# EAGLE design micro-lrs (EAGLE 7.2.0)
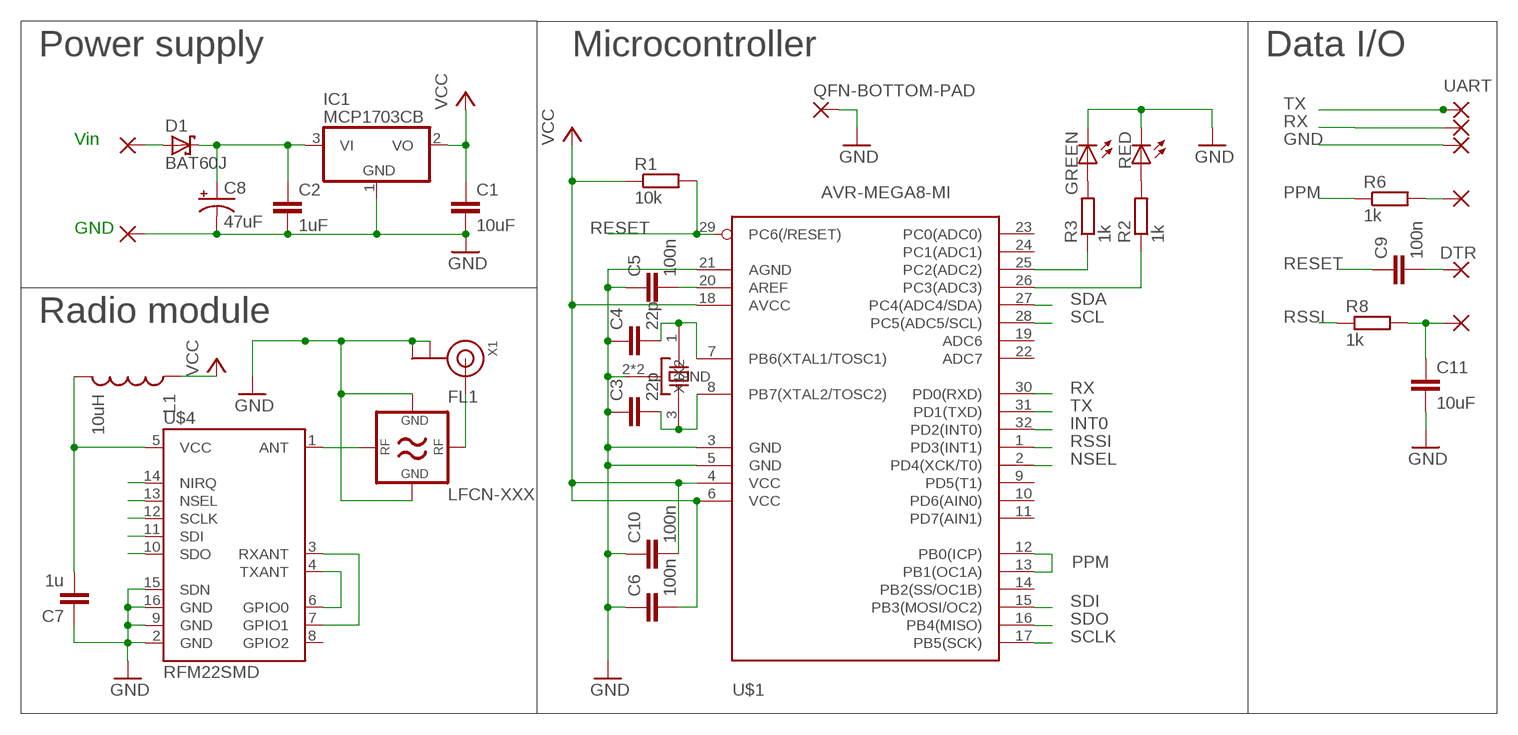
[diagram p0: schematic, sheet 1]

## Parts
+5V  SMD2  [SMD1,27-2,54]
C1  10uF  C-EUC0603  [C0603]
C2  1uF  C-EUC0603  [C0603]
C3  22p  C-EUC0603K  [C0603K]
C4  22p  C-EUC0603K  [C0603K]
C5  100n  C-EUC0603K  [C0603K]
C6  100n  C-EUC0603K  [C0603K]
C7  1u  C-EUC0402  [C0402]
C8  47uF  CAP_POL1206  [EIA3216]
C9  100n  C-EUC0603K  [C0603K]
C10  100n  C-EUC0603K  [C0603K]
C11  10uF  C-EUC0603  [C0603]
D1  BAT60J  [SOD323_ST]
DTR  SMD2  [SMD1,27-2,54]
FL1  LFCN-XXX  [FV1206]
GND  SMD2  [SMD1,27-2,54]
IC1  MCP1703CB  [SOT23]
L1  10uH  INDUCTOR1210  [1210]
LED1  GREEN  LEDCHIPLED_0603  [CHIPLED_0603]
LED2  RED  LEDCHIPLED_0603  [CHIPLED_0603]
PPM  SMD2  [SMD1,27-2,54]
QFN-BOTTOM-PAD  QFN-PAD  [SMD100X100]
R1  10k  R-EU_R0603  [R0603]
R2  1k  R-EU_R0603  [R0603]
R3  1k  R-EU_R0603  [R0603]
R6  1k  R-EU_R0603  [R0603]
R8  1k  R-EU_R0603  [R0603]
RSSI  SMD2  [SMD1,27-2,54]
RX  SMD2  [SMD1,27-2,54]
TX  SMD2  [SMD1,27-2,54]
U$1  AVR-MEGA8-MI  [MLF32]
U$2  CTS_32X25_SMD  [CTS_32X25]
U$4  RFM22SMD  [RFM22-XXX-S2]
UART-GND  SMD2  [SMD1,27-2,54]
X1  ANTENNA_U.FL  [U.FL]

## Nets
ANT-PAD: FL1.1(IO1) U$4.1(ANT)
AREF: C5.2 U$1.20(AREF)
DTR: C9.2 DTR.1(P)
GND: C1.2 C2.2 C3.1 C4.1 C5.1 C6.1 C7.1 C8.C(-) C10.1 C11.2 FL1.3(GND2) FL1.4(GND1) GND.1(P) IC1.1(GND) LED1.C LED2.C QFN-BOTTOM-PAD.P$2(P) U$1.3(GND) U$1.5(GND) U$1.21(AGND) U$2.2(GND) U$2.4(GND) U$4.2(GND) U$4.9(GND) U$4.15(SDN) U$4.16(GND) UART-GND.1(P) X1.1(GND) X1.2(GND)
INT0: U$1.32(PD2(INT0)) U$4.14(NIRQ)
N$2: C4.2 U$1.7(PB6(XTAL1/TOSC1)) U$2.1(X1)
N$3: C3.2 U$1.8(PB7(XTAL2/TOSC2)) U$2.3(X2)
N$4: R3.1 U$1.25(PC2(ADC2))
N$5: R2.1 U$1.26(PC3(ADC3))
N$7: LED1.A R3.2
N$8: LED2.A R2.2
N$12: FL1.2(IO2) X1.3(SIGNAL)
N$16: U$4.4(TXANT) U$4.6(GPIO0)
N$17: U$4.3(RXANT) U$4.7(GPIO1)
NSEL: U$1.2(PD4(XCK/T0)) U$4.13(NSEL)
PPM: R6.1 U$1.12(PB0(ICP)) U$1.13(PB1(OC1A))
PPMPAD: PPM.1(P) R6.2
RESET: C9.1 R1.2 U$1.29(PC6(/RESET))
RSSI: R8.1 U$1.1(PD3(INT1))
RSSIPAD: C11.1 R8.2 RSSI.1(P)
RX: RX.1(P) U$1.30(PD0(RXD))
SCL: U$1.28(PC5(ADC5/SCL))
SCLK: U$1.17(PB5(SCK)) U$4.12(SCLK)
SDA: U$1.27(PC4(ADC4/SDA))
SDI: U$1.15(PB3(MOSI/OC2)) U$4.11(SDI)
SDO: U$1.16(PB4(MISO)) U$4.10(SDO)
TX: TX.1(P) U$1.31(PD1(TXD))
VCC: C1.1 C6.2 C10.2 IC1.2(VO) L1.1 R1.1 U$1.4(VCC) U$1.6(VCC) U$1.18(AVCC)
VCC-RADIO: C7.2 L1.2 U$4.5(VCC)
VIN: C2.1 C8.A(+) D1.C IC1.3(VI)
VIN-BEFORE-DIODE: +5V.1(P) D1.A
Unconnected: U$1.9(PD5(T1)) U$1.10(PD6(AIN0)) U$1.11(PD7(AIN1)) U$1.14(PB2(SS/OC1B)) U$1.19(ADC6) U$1.22(ADC7) U$1.23(PC0(ADC0)) U$1.24(PC1(ADC1)) U$4.8(GPIO2)

## Notes on the sheet
- Power supply | Microcontroller | Data I/O
- UART
- Vin
- GND
- Radio module

## Library data of the parts
+5V DTR GND PPM RSSI RX TX UART-GND = wirepad:SMD2: SMD PAD
C1-C7 C9-C11 = resistor:C-EU: CAPACITOR, European symbol
C8 = SparkFun-Capacitors:CAP_POL: Capacitor Polarized These are standard SMD and PTH capacitors. Normally 10uF, 47uF, and 100uF in electrolytic and tantalum varieties. Always verify the external diameter of the through hole cap, it varies with capacity, voltage, and manufacturer. The EIA devices should be standard.
D1 = diode:BAT60J: Schottky barrier diode Source: www.st.com, BAT60J.pdf
FL1 = mini-circuits:LFCN-XXX: CERAMIC LOW PASS FILTER
IC1 = linear:MCP1703: 250 mA, 16V, Low Quiescent Current LDO Regulator Source: http://ww1.microchip.com/downloads/en/DeviceDoc/22049b.pdf
L1 = SparkFun:INDUCTOR: Inductors Basic Inductor/Choke - 0603 and 1206. Footprints are not proven and vary greatly between part numbers.
LED1 LED2 = led:LED: LED OSRAM: - CHIPLED LG R971, LG N971, LY N971, LG Q971, LY Q971, LO R971, LY R971 LH N974, LH R974 LS Q976, LO Q976, LY Q976 LO Q996 - Hyper CHIPLED LW Q18S LB Q993, LB Q99A, LB R99A - SideLED LS A670, LO A670, LY A670, LG A670, LP A670 LB A673, LV A673, LT A673, LW A673 LH A674 LY A675 LS A676, LA A676, LO A676, LY A676, LW A676 LS A679, LY A679, LG A679 - Hyper Micro SIDELED® LS Y876, LA Y876, LO Y876, LY Y876 LT Y87S - SmartLED LW L88C, LW L88S LB L89C, LB L89S, LG L890 LS L89K, LO L89K, LY L89K LS L896, LA L896, LO L896, LY L896 - TOPLED LS T670, LO T670, LY T670, LG T670, LP T670 LSG T670, LSP T670, LSY T670, LOP T670, LYG T670 LG T671, LOG T671, LSG T671 LB T673, LV T673, LT T673, LW T673 LH T674 LS T676, LA T676, LO T676, LY T676, LB T676, LH T676, LSB T676, LW T676 LB T67C, LV T67C, LT T67C, LS T67K, LO T67K, LY T67K, LW E67C LS E67B, LA E67B, LO E67B, LY E67B, LB E67C, LV E67C, LT E67C LW T67C LS T679, LY T679, LG T679 LS T770, LO T770, LY T770, LG T770, LP T770 LB T773, LV T773, LT T773, LW T773 LH T774 LS E675, LA E675, LY E675, LS T675 LS T776, LA T776, LO T776, LY T776, LB T776 LHGB T686 LT T68C, LB T68C - Hyper Mini TOPLED® LB M676 - Mini TOPLED Santana® LG M470 LS M47K, LO M47K, LY M47K Source: http://www.osram.convergy.de - LUMILED® LXK2-PW12-R00, LXK2-PW12-S00, LXK2-PW14-U00, LXK2-PW14-V00 LXK2-PM12-R00, LXK2-PM12-S00, LXK2-PM14-U00 LXK2-PE12-Q00, LXK2-PE12-R00, LXK2-PE12-S00, LXK2-PE14-T00, LXK2-PE14-U00 LXK2-PB12-K00, LXK2-PB12-L00, LXK2-PB12-M00, LXK2-PB14-N00, LXK2-PB14-P00, LXK2-PB14-Q00 LXK2-PR12-L00, LXK2-PR12-M00, LXK2-PR14-Q00, LXK2-PR14-R00 LXK2-PD12-Q00, LXK2-PD12-R00, LXK2-PD12-S00 LXK2-PH12-R00, LXK2-PH12-S00 LXK2-PL12-P00, LXK2-PL12-Q00, LXK2-PL12-R00 Source: www.luxeon.com
QFN-BOTTOM-PAD = wirepad2:QFN-PAD: SMD PAD
R1-R3 R6 R8 = resistor:R-EU_: RESISTOR, European symbol
U$1 = SparkFun:AVR-MEGA8: MICROCONTROLLER 8 Kbytes FLASH 1 kbytes SRAM 512 bytes EEPROM USART 6-channel 10 bit ADC 2-channel 8 bit ADC
U$2 = cts_crystal:CTS_32X25_SMD
U$4 = SparkFun-RF-small:RFM22: The RFM22 is a low-power, low cost radio that is capable of operating in the 434MHz and 900MHz open bands. It's frequency is software defined and there are some very good libraries written for it.
X1 = adafruit:ANTENNA_U.FL: U.FL Antenna Connector

## Board
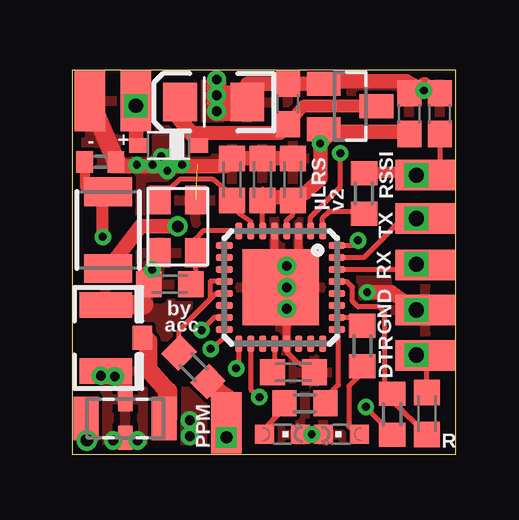
[diagram p1: board, top side]
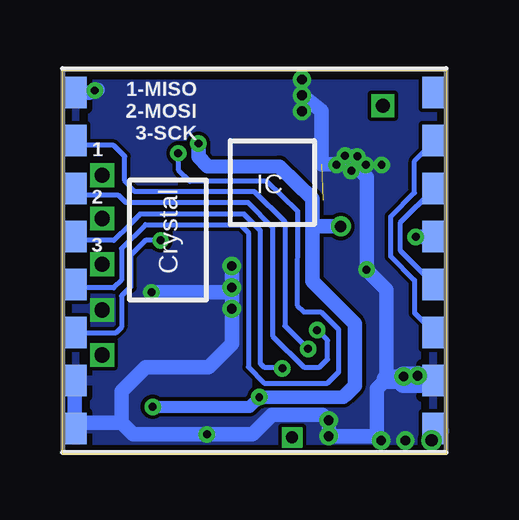
[diagram p2: board, bottom side, seen from below]

Size 16 x 16 mm. Coordinates in mm from the lower left corner, seen from the top.
Outline: 0,0 16,0 16,16 0,16 0,0
Copper layers (1*16): Top 0.0356mm / dielectric 1.5011mm / Bottom 0.0356mm
Design rules "oshpark-design-rules *": minimum track width 6mil, minimum drill 13mil, track to track 6mil, track to pad 6mil, pad to pad 6mil, via to via 6mil, smd to smd 6mil, copper to edge 15mil, drill to drill 6mil, minimum pad ring 7mil, minimum via ring 7mil, stop-mask expansion 3mil, vias tented up to drill 25mil, thermal gap 10mil

### Footprints (pad centres in the part's own frame; a part is rotated, then mirrored left to right if it is on the bottom)
SMD1,27-2,54 = smd 1.27 x 2.54: 1 0,0
C0603 = smd 1.1 x 1: 1 -0.85,0; 2 0.85,0
C0603K = smd 1.05 x 1.08: 1 -0.875,0; 2 0.875,0
C0402 = smd 0.7 x 0.9: 1 -0.65,0; 2 0.65,0
EIA3216 = smd 1.4 x 1.6: A 1.4,0; C -1.4,0
SOD323_ST = smd 0.8 x 0.6: A 1.25,0; C -1.25,0
FV1206 = smd 1.04 x 1.8: 1 -1.625,0; 2 1.625,0 | smd 0.6 x 1: 3 0,0.8; 4 0,-0.8
SOT23 = smd 1 x 1.4: 1 -0.95,-1.1; 2 0.95,-1.1; 3 0,1.1
1210 = smd 1.2 x 2: 1 -1.6,0; 2 1.6,0
CHIPLED_0603 = smd 0.8 x 0.8: A 0,-0.75; C 0,0.75
SMD100X100 = smd 3.175 x 3.175: P$2 0,0
R0603 = smd 1 x 1.1: 1 -0.85,0; 2 0.85,0
MLF32 = smd 0.7 x 0.3: 1 -2.35,1.75; 2 -2.35,1.25; 3 -2.35,0.75; 4 -2.35,0.25; 5 -2.35,-0.25; 6 -2.35,-0.75; 7 -2.35,-1.25; 8 -2.35,-1.75; 17 2.35,-1.75; 18 2.35,-1.25; 19 2.35,-0.75; 20 2.35,-0.25; 21 2.35,0.25; 22 2.35,0.75; 23 2.35,1.25; 24 2.35,1.75 | smd 0.3 x 0.7: 9 -1.75,-2.35; 10 -1.25,-2.35; 11 -0.75,-2.35; 12 -0.25,-2.35; 13 0.25,-2.35; 14 0.75,-2.35; 15 1.25,-2.35; 16 1.75,-2.35; 25 1.75,2.35; 26 1.25,2.35; 27 0.75,2.35; 28 0.25,2.35; 29 -0.25,2.35; 30 -0.75,2.35; 31 -1.25,2.35; 32 -1.75,2.35
CTS_32X25 = smd 1.2 x 0.9: 1 -1.1,-0.7; 2 1.1,-0.7; 3 1.1,0.8; 4 -1.1,0.8
RFM22-XXX-S2 = smd 1 x 1.3: 1 -7.5,7; 2 -7.5,5; 3 -7.5,3; 4 -7.5,1; 5 -7.5,-1; 6 -7.5,-3; 7 -7.5,-5; 8 -7.5,-7; 9 7.5,-7; 10 7.5,-5; 11 7.5,-3; 12 7.5,-1; 13 7.5,1; 14 7.5,3; 15 7.5,5; 16 7.5,7
U.FL = smd 2.2 x 1.05: 1 0,1.375; 2 0,-1.375 | smd 0.8 x 1: 3 1.525,0

### Placement (x,y rotation side)
+5V  2.64,14.73 180 top
C1  14.05,14.2 90 top
C2  8.99,14.61 90 top
C3  4.06,7.09 0 top
C4  6.65,11.46 270 top
C5  9.22,3.43 180 top
C6  9.19,11.46 270 top
C7  1.17,12.19 180 top
C8  5.89,14.68 180 top
C9  14.78,1.7 90 top
C10  7.92,11.46 270 top
C11  15.32,14.2 90 top
D1  4.01,12.88 180 top
DTR  14.73,4.11 90 top
FL1  2.21,1.5 0 top
GND  0.74,14.73 180 top
IC1  11.58,14.5 270 top
L1  1.5,9.35 90 top
LED1  8.76,0.84 270 top
LED2  11.23,0.84 90 top
PPM  6.43,1.32 180 top
QFN-BOTTOM-PAD  8.69,6.96 0 top
R1  13.34,1.68 90 top
R2  12.09,4.52 270 top
R3  9.7,2.13 180 top
R6  5.05,3.63 315 top
R8  12.17,10.87 90 top
RSSI  14.73,11.63 90 top
RX  14.73,7.9 90 top
TX  14.73,9.83 90 top
U$1  8.69,6.96 270 top
U$2  4.34,9.5 270 top
U$4  8,8.08 180 bottom
UART-GND  14.73,6.02 270 top
X1  1.4,4.85 0 top

### Tracks (layer width: path | path; a pad name or v marks a point on that pad's centre or on a via)
ANT-PAD  (via drill 0.51)
  Top 0.813: FL1.1 0.66,1.07 v0.61,0.58
  Bottom 0.406: 0.29,0.99 U$4.1
  Bottom 0.813: v0.61,0.58 0.33,0.99 0.29,0.99
AREF
  Top 0.203: U$1.20 8.44,3.55 C5.2
DTR  (via drill 0.64)
  Top 0.203: C9.2 14.78,4.04 DTR.1
  Top 0.406: DTR.1 15.16,3.99 v14.35,4.14
GND  (via drill 0.33, 0.41, 0.64)  (1 unrouted)
  Top 0.203: v3.33,7.7 3.17,6.89 C3.1 2.97,7.1 2.97,7.59 | LED1.C 9.65,0.79 | U$1.21 8.96,4.25 9.35,3.86 9.64,3.73 C5.1 | 8.44,6.96 QFN-BOTTOM-PAD.P$2 | U$2.2 3.67,8.29 | LED1.C LED2.C | v9.98,0.84 9.7,0.72 LED1.C | C8.C 7.18,15.34 C2.2
  Top 0.305: 8.44,6.96 U$1.5 | U$1.3 9.44,6.96 v8.94,6.96 QFN-BOTTOM-PAD.P$2 v8.94,6.96 U$1.21
  Top 0.406: 3.67,8.29 v3.33,7.7 | v3.33,7.7 2.97,7.59 | 2.97,6.23 v3.33,7.7 | v14.35,6.02 14.5,6.12 UART-GND.1 | v1.7,0.58 1.89,0.58 FL1.4 2.53,0.58 v2.72,0.58 | v4.9,0.76 v4.9,1.42
  Top 0.61: C6.1 C10.1 C4.1 | 10.08,15.58 IC1.1 | 6.34,12.09 C4.1 | C2.2 7.31,15.45 IC1.1 | IC1.1 10.6,15.45 10.69,15.54 13.94,15.54 v14.66,15.16 14.2,15.29 C1.2 14.68,15.42 C11.2 | v12.29,6.76 13.31,6.76 v14.35,6.02 | 2.19,2.52 2.18,3.26 v1.78,3.25 1.78,3.28 v1.19,3.28 | X1.2 2.21,3.48 FL1.3 | v3.96,11.81 3.89,12.42 v4.22,12.45 | C7.1 2,12.01 6.34,12.01 arc90 C4.1
  Top 0.813: X1.1 2.97,6.23 | GND.1 1.8,12.23 C7.1 | v6.02,14.96 7.01,14.96 C8.C | v6.02,14.3 6.91,14.3 C8.C | v6.02,15.62 6.02,14.68 C8.C
  Bottom 0.61: v8.94,7.85 v8.94,6.96 | v8.94,6.96 v8.94,6.07 U$1.21 9.91,3.63 12.55,3.63 13.54,2.64 13.54,1.32 | v14.66,15.16 14.53,15.19 14.89,15.08 U$4.9 | 3.83,12.09 5.21,12.09 5.21,14.33 v6.02,14.96 | 3.83,12.09 3.3,11.56 3.3,7.72 v3.33,7.7 2.49,6.86 2.49,3.12 2.9,2.74 2.9,0.76 | v12.29,6.76 9.14,6.76 v8.94,6.96 | 13.54,1.32 13.06,0.84 v9.98,0.84 8.08,0.84 7.26,1.65 5.16,1.65 4.93,1.42 v4.9,1.42 v4.9,0.76 2.97,0.76 | 13.54,1.32 15.26,1.32 U$4.16 U$4.15 | 2.97,0.76 2.9,0.76 | 2.97,0.76 2.79,0.58 v2.72,0.58 2.9,0.76 | v4.22,12.45 v3.71,12.42 3.83,12.14 3.83,12.09 | 1.78,3.12 v1.78,3.25
  Bottom 0.813: U$4.2 0.61,2.97 1.78,2.97 v1.78,3.25 1.19,3.25 v1.19,3.28 | 2.49,3.12 1.78,3.12
  other vias: 3.35,12.06 2.69,12.06 4.57,12.06
  pour Top: -0.99,16.84 16.84,16.84 17.17,-0.66 -0.66,-0.66
  pour Bottom: -0.99,16.84 16.84,16.84 16.84,-0.66 -0.99,-0.66
INT0  (via drill 0.33)
  Top 0.203: U$1.32 11.71,8.71 v11.91,8.91
  Bottom 0.203: v11.91,8.91 12.55,8.91 13.16,8.31 13.16,6.99 13.54,6.6 13.54,5.31 13.79,5.05 15.48,5.05 U$4.14 15.29,5.28
N$1  (via drill 0.64)
  other vias: 14.35,7.92
N$2
  Top 0.203: U$2.1 3.73,10.66 3.73,10.77 4.47,11.46 5.87,11.46 6.51,10.91 C4.2 6.91,10.66 6.96,10.03 7.44,9.71 U$1.7
N$3
  Top 0.203: U$1.8 5.45,9.31 5.13,8.99 5.13,8.44 U$2.3 5.17,7.08 C3.2
N$4
  Top 0.203: R3.1 10.55,2.35 11.1,2.9 11.1,5.15 U$1.25
N$5
  Top 0.203: U$1.26 11.78,5.71 R2.1
N$7
  Top 0.203: R3.2 8.85,1.92 7.8,0.86 7.9,0.83 LED1.A
N$8
  Top 0.203: 11.81,0.6 LED2.A 11.53,1.16 11.53,2.85 12.14,3.43 R2.2
N$12
  Top 0.406: X1.3 2.97,5.08 | 3.96,1.5 FL1.2
  Top 0.762: 3.96,2.64 3.15,3.56 3.15,4.72 X1.3
  Top 0.813: 3.96,2.64 3.96,1.5
N$14  (via drill 0.64)
  other vias: 14.35,9.83
N$15  (via drill 0.64)
  other vias: 14.35,11.63
N$16
  Bottom 0.203: 0.81,11.08 U$4.6 1.91,9.67 1.91,8.48 U$4.4
N$17
  Bottom 0.203: U$4.7 0.5,13.04 1.32,12.22 1.32,10.9 2.31,9.91 2.31,8.26 1.32,7.26 1.32,5.9 U$4.3 0.79,5.08
NSEL  (via drill 0.33)
  Top 0.203: U$1.2 9.94,9.89 11.18,11.15 v11.18,12.55
  Bottom 0.203: U$4.13 15.36,6.93 13.87,6.93 13.54,7.26 13.54,8.59 12.55,9.58 8.59,9.58 8.26,9.25 8.26,3.63 7.59,2.97 4.95,2.97 4.5,3.43 4.5,5.21 5.23,5.94 5.94,5.94 6.22,6.22 6.2,10.13 7.49,11.38 10.69,11.38 11.18,11.86 v11.18,12.55
PPM
  Top 0.203: U$1.13 6.07,6.71 6.02,6.73 5.75,6.46 | U$1.12 5.75,7.21 5.75,6.46 | R6.1 4.45,5.17 5.75,6.46
PPMPAD  (via drill 0.5)
  Top 0.203: 6.59,2.22 PPM.1
  Top 0.406: PPM.1 v6.43,0.71
  Top 0.813: 6.59,2.22 6.21,2.48 R6.2
RESET
  Top 0.203: C9.1 13.34,2.25 R1.2 13.03,2.73 13.03,5.92 12.8,6.15 11.91,6.15 11.68,6.38 11.68,6.96 11.43,7.21 U$1.29
RSSI
  Top 0.203: R8.1 12.37,10.41 12.52,10.24 11.86,10.19 11.84,10.13 10.72,10.13 10.44,9.85 U$1.1
RSSIPAD
  Top 0.203: C11.1 15.32,12.19 RSSI.1
  Top 0.508: RSSI.1 14.81,11.71 14.55,11.79 R8.2
RX
  Top 0.203: U$1.30 14.41,7.71 RX.1
SCLK  (via drill 0.33)
  Top 0.203: U$1.17 6.94,3.69 v6.83,3.58
  Bottom 0.203: 15.27,8.99 15.4,9.2 U$4.12 15.34,8.91 13.87,8.91 13.21,9.58 12.88,9.91 12.78,10.01 8.43,10.01 7.75,9.32 7.75,3.79 7.59,3.63 6.88,3.63 v6.83,3.58
SDI  (via drill 0.33)
  Top 0.203: U$1.15 5.91,5.71 v5.38,5.18
  Bottom 0.203: 15.06,10.77 15.49,10.9 15.24,10.85 15.67,11.08 U$4.11 15.45,10.79 13.66,10.79 13.36,10.49 8.26,10.49 7.24,9.47 7.24,4.93 5.94,3.63 5.28,3.63 4.95,3.96 4.95,4.75 v5.38,5.18
SDO  (via drill 0.33)
  Top 0.203: U$1.16 6.34,4.86 v5.77,4.39
  Bottom 0.203: U$4.10 15.3,12.88 13.87,12.88 13.41,12.42 13.41,11.4 12.98,10.95 8,10.95 6.73,9.7 6.73,5.36 v5.77,4.39
TX
  Top 0.203: U$1.31 12.17,8.21 13.79,9.83 TX.1
VCC  (via drill 0.33, 0.48)
  Top 0.203: 7.94,11.05 C10.2 | U$1.6 7.94,10.8 C10.2 | 8.18,10.71 C10.2 | U$1.4 8.94,9.75 9.2,10.01 C6.2 9.07,10.71 | U$1.18 7.44,2.72 v7.8,2.39 | L1.1 1.61,7.91 | R1.1 13.34,0.86 v12.24,1.98
  Top 0.61: 8.18,10.71 9.07,10.71 | C6.2 9.72,10.91 10.34,11.46 v10.34,12.95 10.39,13.01 10.36,13.03 10.34,13.46 IC1.2 10.4,12.98 10.79,13.44 13.78,13.45 13.91,13.23 C1.1 | 1.61,7.91 2.85,9.5 v4.39,9.5
  Bottom 0.508: v12.24,1.98 8.2,1.98 v7.8,2.39
  Bottom 0.559: v7.8,2.39 4.29,2.39 4.19,2.49
  Bottom 0.61: v10.34,12.95 10.34,12.39 9.96,12.01 6.96,11.99 5.59,10.64 5.59,9.25 | 5.59,9.25 5.59,7.21 3.81,5.44 3.81,2.87 4.19,2.49 | v4.39,9.5 5.33,9.5 arc-90 5.59,9.25
VCC-RADIO  (via drill 0.33)
  Top 0.406: C7.2 0.52,11.14 0.99,10.9 1.4,10.9 L1.2
  Top 0.508: L1.2 1.27,10.51 v1.27,9.07
  Bottom 0.61: v1.27,9.07 0.55,9.07 U$4.5
VIN
  Top 0.406: 8.66,13.39 C2.1
  Top 0.508: 9.63,14.5 C2.1
  Top 0.533: IC1.3 9.63,14.5
  Top 0.584: 8.66,13.39 4.93,13.39
  Top 0.61: D1.C 5.19,13.14 4.93,13.39 4.95,13.44 4.47,13.92 4.47,14.66 C8.A
VIN-BEFORE-DIODE  (via drill 0.6)
  Top 0.203: 2.76,14.85 +5V.1 | v2.64,14.53 2.97,14.88 2.67,14.63
  Top 0.508: D1.A 2.67,12.98
  Top 0.61: 2.67,12.98 2.67,14.63 +5V.1

### Text on the board
tPlace: - | + | RSSI | µLRS | v2 | TX | GND | RX | by | acc | DTR | PPM | R
bPlace: 1-MISO / 2-MOSI / 3-SCK | 1 | 2 | 3